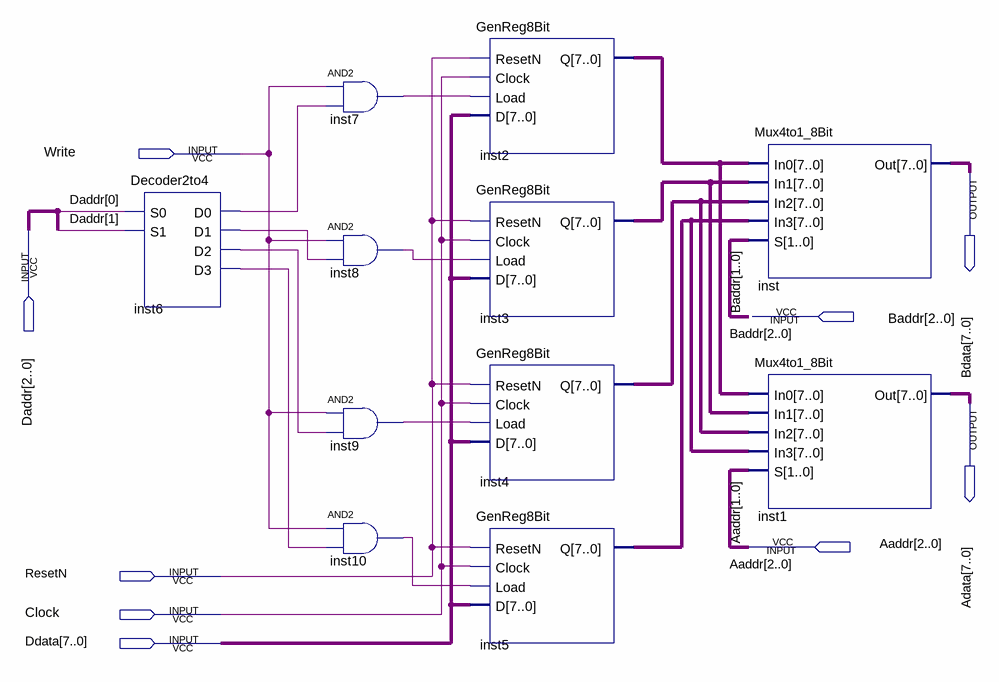
[diagram p0: schematic sheet]
// Quartus schematic RegisterFile.bdf as structural Verilog: 11 symbols, 9 pins
module RegisterFile (
  input  Write,
  input  [2:0] Daddr,
  input  [2:0] Baddr,
  input  [2:0] Aaddr,
  input  ResetN,
  input  Clock,
  input  [7:0] Ddata,
  output [7:0] Bdata,
  output [7:0] Adata
);

  wire inst6_d0, inst6_d1, inst6_d2, inst6_d3, inst7_out, inst8_out, inst9_out, inst10_out;
  wire [7:0] inst2_q, inst3_q, inst4_q, inst5_q;

  Decoder2to4 inst6 (.S0(Daddr[0]), .S1(Daddr[1]), .D0(inst6_d0), .D1(inst6_d1), .D2(inst6_d2), .D3(inst6_d3));
  and inst7 (inst7_out, Write, inst6_d0);
  and inst8 (inst8_out, Write, inst6_d1);
  and inst9 (inst9_out, Write, inst6_d2);
  and inst10 (inst10_out, Write, inst6_d3);
  GenReg8Bit inst2 (.ResetN(ResetN), .Clock(Clock), .Load(inst7_out), .D(Ddata), .Q(inst2_q));
  GenReg8Bit inst3 (.ResetN(ResetN), .Clock(Clock), .Load(inst8_out), .D(Ddata), .Q(inst3_q));
  GenReg8Bit inst4 (.ResetN(ResetN), .Clock(Clock), .Load(inst9_out), .D(Ddata), .Q(inst4_q));
  GenReg8Bit inst5 (.ResetN(ResetN), .Clock(Clock), .Load(inst10_out), .D(Ddata), .Q(inst5_q));
  Mux4to1_8Bit inst (.In0(inst2_q), .In1(inst3_q), .In2(inst4_q), .In3(inst5_q), .S(Baddr[1:0]), .Out(Bdata));
  Mux4to1_8Bit inst1 (.In0(inst2_q), .In1(inst3_q), .In2(inst4_q), .In3(inst5_q), .S(Aaddr[1:0]), .Out(Adata));
endmodule
